# Altium schematic sheet RS485.SchDoc
size A3
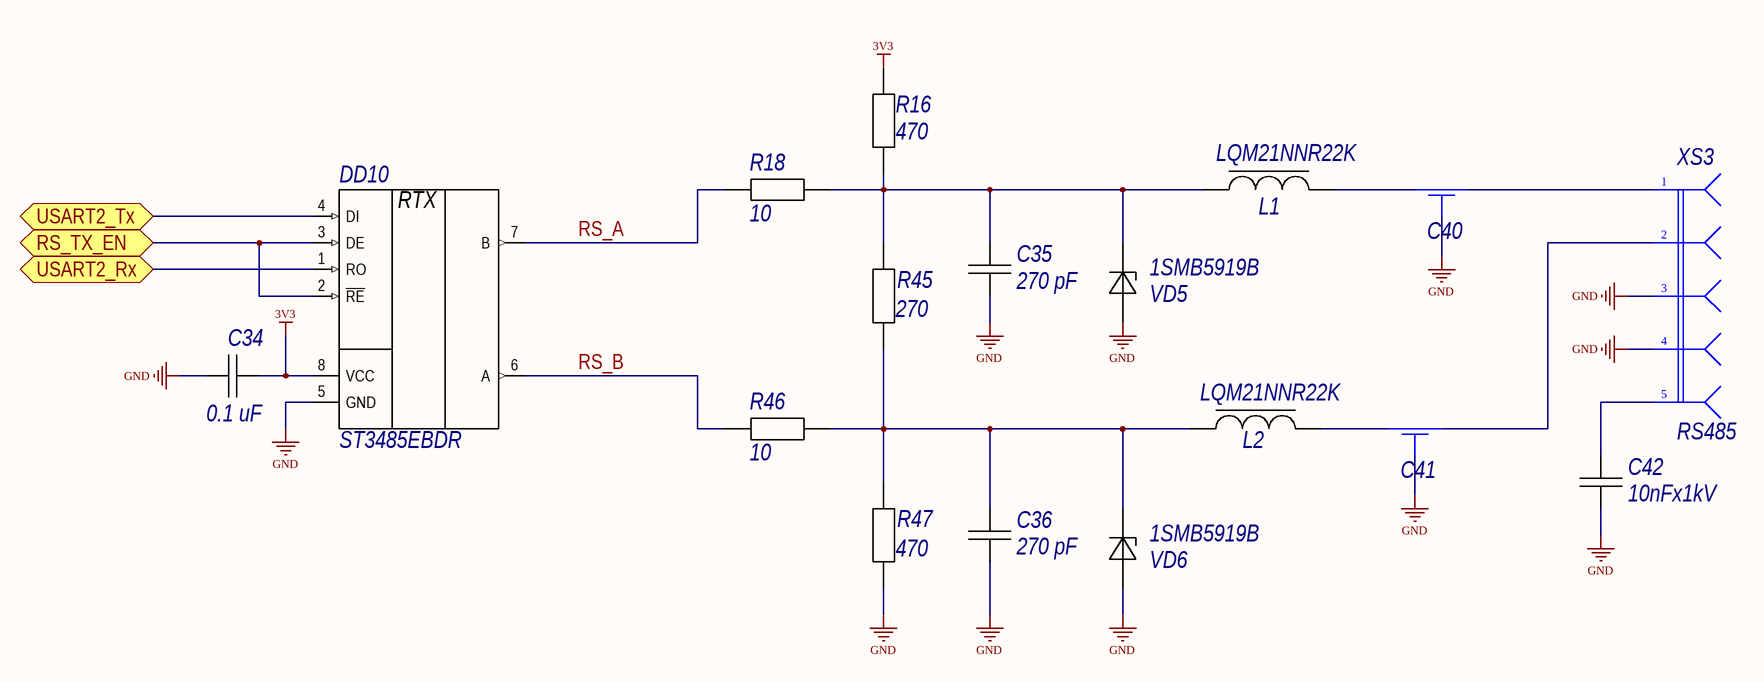
[diagram p0: RS485.SchDoc]

## Parts
C34  0.1 uF  [C0805C]
C35  270 pF  [C0805C]
C36  270 pF  [C0805C]
C40  NFM3DCC222R1H3L  [NFM3DCC222R1H3L]  (value not drawn)
C41  NFM3DCC222R1H3L  [NFM3DCC222R1H3L]  (value not drawn)
C42  10nFx1kV  [C0805C]
DD10  ST3485EBDR  [SOIC8 (SO-8)]
L1  LQM21NNR22K  [L0805]
L2  LQM21NNR22K  [L0805]
R16  470  [C0805R]
R18  10  [C0805R]
R45  270  [C0805R]
R46  10  [C0805R]
R47  470  [C0805R]
VD5  1SMB5919B  [DO214AA SMB]
VD6  1SMB5919B  [DO214AA SMB]
XS3  RS485  [WF-5]

## Ports
RS_TX_EN (bidir), USART2_Rx (bidir), USART2_Tx (bidir)

## Nets
3V3: C34.2 DD10.8(VCC) R16.1
GND: C34.1 C35.1 C36.1 C40.2 C41.2 C42.1 DD10.5(GND) R47.1 VD5.1(А) VD6.1(А) XS3.3 XS3.4
RS_A: DD10.7(B) R18.2
RS_B: DD10.6(A) R46.2
RS_TX_EN: DD10.2(~{RE}) DD10.3(DE) ; port RS_TX_EN
USART2_Rx: DD10.1(RO) ; port USART2_Rx
USART2_Tx: DD10.4(DI) ; port USART2_Tx
NetC35_2: C35.2 L1.1 R16.2 R18.1 R45.2 VD5.2(К)
NetC36_2: C36.2 L2.1 R45.1 R46.1 R47.2 VD6.2(К)
NetC40_1: C40.1 L1.2
NetC40_3: C40.3 XS3.1
NetC41_1: C41.1 L2.2
NetC41_3: C41.3 XS3.2
NetC42_2: C42.2 XS3.5

## Notes on the sheet
- (in symbol ST3485EBDR) RTX

## Library data of the parts
C34-C36 = CAP_0805: Type: Конденсатор; Published: 18.05.2010; Publisher: Andrew Danich
C40 C41 = NFM3DCC222R1H3L: Type: Конденсатор; Published: 06.07.2014; Publisher: Andrew Danich
C42 = CAP_1206: Type: Конденсатор; Published: 18.05.2010; Publisher: Andrew Danich
L1 L2 = LQM21NNR22K: Type: Дроссель; Published: 20.05.2010; Publisher: Andrew Danich
R16 R18 R45-R47 = RES_0805: Published: 24.03.2010; Publisher: Andrew Danich; Type: Резистор
VD5 VD6 = 1SMB5919B: Type: Стабилитрон; Published: 20.05.2013; Publisher: Andrew Danich
XS3 = CONNECT_SEQ: Value: Connector; Published: 07.03.2013; Publisher: Andrew Danich; Type: Розетка
DD10 = ST3485EBDR: Published: 26.02.2013; Publisher: Andrew Danich; Type: Микросхема